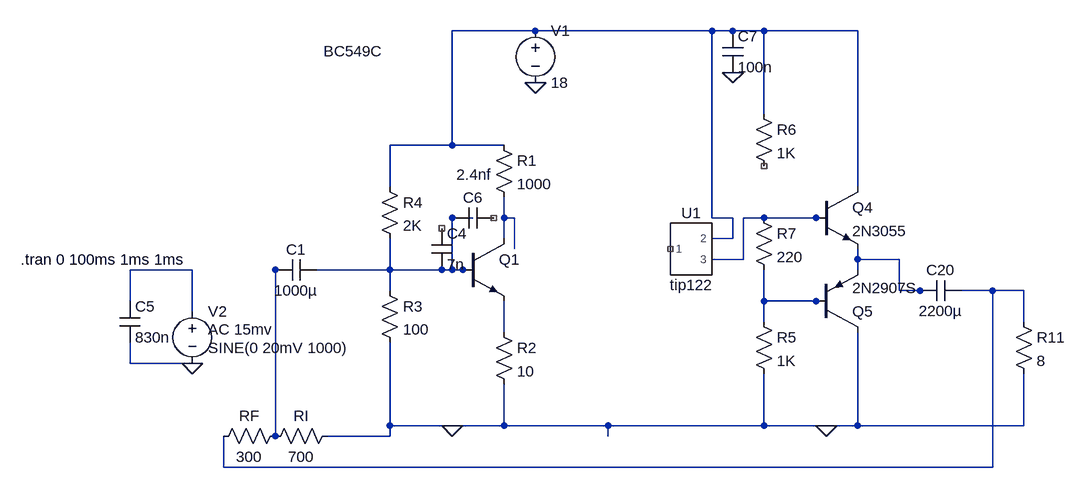
[diagram p0: schematic Push pull without bypass caps without diodes.asc]
Push pull without bypass caps without diodes.asc, the LTspice schematic file:
Version 4
SHEET 1 1788 680
WIRE 272 -256 144 -256
WIRE 544 -256 272 -256
WIRE 576 -256 544 -256
WIRE 624 -256 576 -256
WIRE 768 -256 624 -256
WIRE 624 -128 624 -256
WIRE 144 -80 144 -256
WIRE 144 -80 48 -80
WIRE 224 -80 144 -80
WIRE 48 -16 48 -80
WIRE 768 -16 768 -256
WIRE 176 32 144 32
WIRE 224 32 224 0
WIRE 240 32 224 32
WIRE 544 32 544 -256
WIRE 576 32 544 32
WIRE 624 32 592 32
WIRE 704 32 624 32
WIRE 720 32 704 32
WIRE 224 64 224 32
WIRE 576 64 576 32
WIRE 576 64 544 64
WIRE 240 80 240 32
WIRE 592 96 592 32
WIRE 592 96 544 96
WIRE 768 96 768 80
WIRE 832 96 768 96
WIRE -256 112 -352 112
WIRE -112 112 -128 112
WIRE 48 112 48 64
WIRE 48 112 -64 112
WIRE 128 112 48 112
WIRE 144 112 144 32
WIRE 144 112 128 112
WIRE 160 112 144 112
WIRE 176 112 160 112
WIRE 768 112 768 96
WIRE 48 144 48 112
WIRE 832 144 832 96
WIRE 864 144 832 144
WIRE 880 144 864 144
WIRE 976 144 928 144
WIRE 1024 144 976 144
WIRE -352 160 -352 112
WIRE 624 160 624 112
WIRE 704 160 624 160
WIRE 720 160 704 160
WIRE -256 176 -256 112
WIRE 624 192 624 160
WIRE 1024 192 1024 144
WIRE 224 208 224 160
WIRE -352 256 -352 224
WIRE -272 256 -352 256
WIRE 48 352 48 224
WIRE 144 352 48 352
WIRE 224 352 224 288
WIRE 224 352 144 352
WIRE 384 352 224 352
WIRE 624 352 624 272
WIRE 624 352 384 352
WIRE 720 352 624 352
WIRE 768 352 768 208
WIRE 768 352 720 352
WIRE 1024 352 1024 272
WIRE 1024 352 768 352
WIRE -128 368 -128 112
WIRE 48 368 48 352
WIRE 48 368 -48 368
WIRE 384 368 384 352
WIRE -208 416 -208 368
WIRE 976 416 976 144
WIRE 976 416 -208 416
FLAG 272 -176 0
FLAG 144 352 0
FLAG -256 256 0
FLAG 576 -192 0
FLAG 720 352 0
SYMBOL npn 160 64 R0
WINDOW 3 -214 -289 Left 2
SYMATTR Value BC549C
SYMATTR InstName Q1
SYMBOL res 208 -96 R0
SYMATTR InstName R1
SYMATTR Value 1000
SYMBOL voltage 272 -272 R0
WINDOW 123 0 0 Left 2
WINDOW 39 0 0 Left 2
SYMATTR InstName V1
SYMATTR Value 18
SYMBOL res 32 -32 R0
SYMATTR InstName R4
SYMATTR Value 2K
SYMBOL res 32 128 R0
SYMATTR InstName R3
SYMATTR Value 100
SYMBOL res 208 192 R0
SYMATTR InstName R2
SYMATTR Value 10
SYMBOL cap -64 96 R90
WINDOW 0 0 32 VBottom 2
WINDOW 3 32 32 VTop 2
SYMATTR InstName C1
SYMATTR Value 1000µ
SYMBOL voltage -256 160 R0
WINDOW 123 24 44 Left 2
WINDOW 39 0 0 Left 2
WINDOW 3 24 72 Left 2
SYMATTR Value2 AC 15mv
SYMATTR Value SINE(0 20mV 1000)
SYMATTR InstName V2
SYMBOL res -112 352 R90
WINDOW 0 0 56 VBottom 2
WINDOW 3 32 56 VTop 2
SYMATTR InstName RF
SYMATTR Value 300
SYMBOL res -32 352 R90
WINDOW 0 0 56 VBottom 2
WINDOW 3 32 56 VTop 2
SYMATTR InstName RI
SYMATTR Value 700
SYMBOL cap 112 48 R0
SYMATTR InstName C4
SYMATTR Value 7n
SYMBOL cap -368 160 R0
SYMATTR InstName C5
SYMATTR Value 830n
SYMBOL cap 208 16 R90
WINDOW 0 0 32 VBottom 2
WINDOW 3 -66 30 VTop 2
SYMATTR InstName C6
SYMATTR Value 2.4nf
SYMBOL cap 560 -256 R0
SYMATTR InstName C7
SYMATTR Value 100n
SYMBOL npn2 704 -16 R0
SYMATTR InstName Q4
SYMATTR Value 2N3055
SYMBOL res 1008 176 R0
SYMATTR InstName R11
SYMATTR Value 8
SYMBOL pnp 704 208 M180
SYMATTR InstName Q5
SYMATTR Value 2N2907S
SYMBOL cap 928 128 R90
WINDOW 0 0 32 VBottom 2
WINDOW 3 32 32 VTop 2
SYMATTR InstName C20
SYMATTR Value 2200µ
SYMBOL res 608 176 R0
SYMATTR InstName R5
SYMATTR Value 1K
SYMBOL res 608 -144 R0
SYMATTR InstName R6
SYMATTR Value 1K
SYMBOL res 608 16 R0
SYMATTR InstName R7
SYMATTR Value 220
SYMBOL AutoGenerated\\tip122 512 80 R0
SYMATTR InstName U1
TEXT -520 96 Left 2 !.tran 0 100ms 1ms 1ms

The netlist it stands for:
* Push pull without bypass caps without diodes.asc
Q1 N003 N002 N010 0 BC549C
R1 N001 N003 1000
V1 N001 0 18
R4 N001 N002 2K
R3 N002 0 100
R2 N010 0 10
C1 N002 N007 1000µ
V2 N006 0 SINE(0 20mV 1000) AC 15mv
RF N007 N008 300
RI 0 N007 700
C4 NC_01 N002 7n
C5 N006 N011 830n
C6 NC_02 N002 2.4nf
C7 N001 0 100n
Q4 N001 N004 N005 0 2N3055
R11 N008 0 8
Q5 0 N009 N005 0 2N2907S
C20 N008 N005 2200µ
R5 N009 0 1K
R6 N001 NC_03 1K
R7 N004 N009 220
XU1 NC_04 N001 N004 tip122  ; pins 1 2 3
.model NPN NPN
.model PNP PNP
.lib standard.bjt
.tran 0 100ms 1ms 1ms
.lib F:\electronics\LTspiceIV\mycircuits\TIP122.SP3
.backanno
.end